# EAGLE schematic midterm (EAGLE 9.3.1)
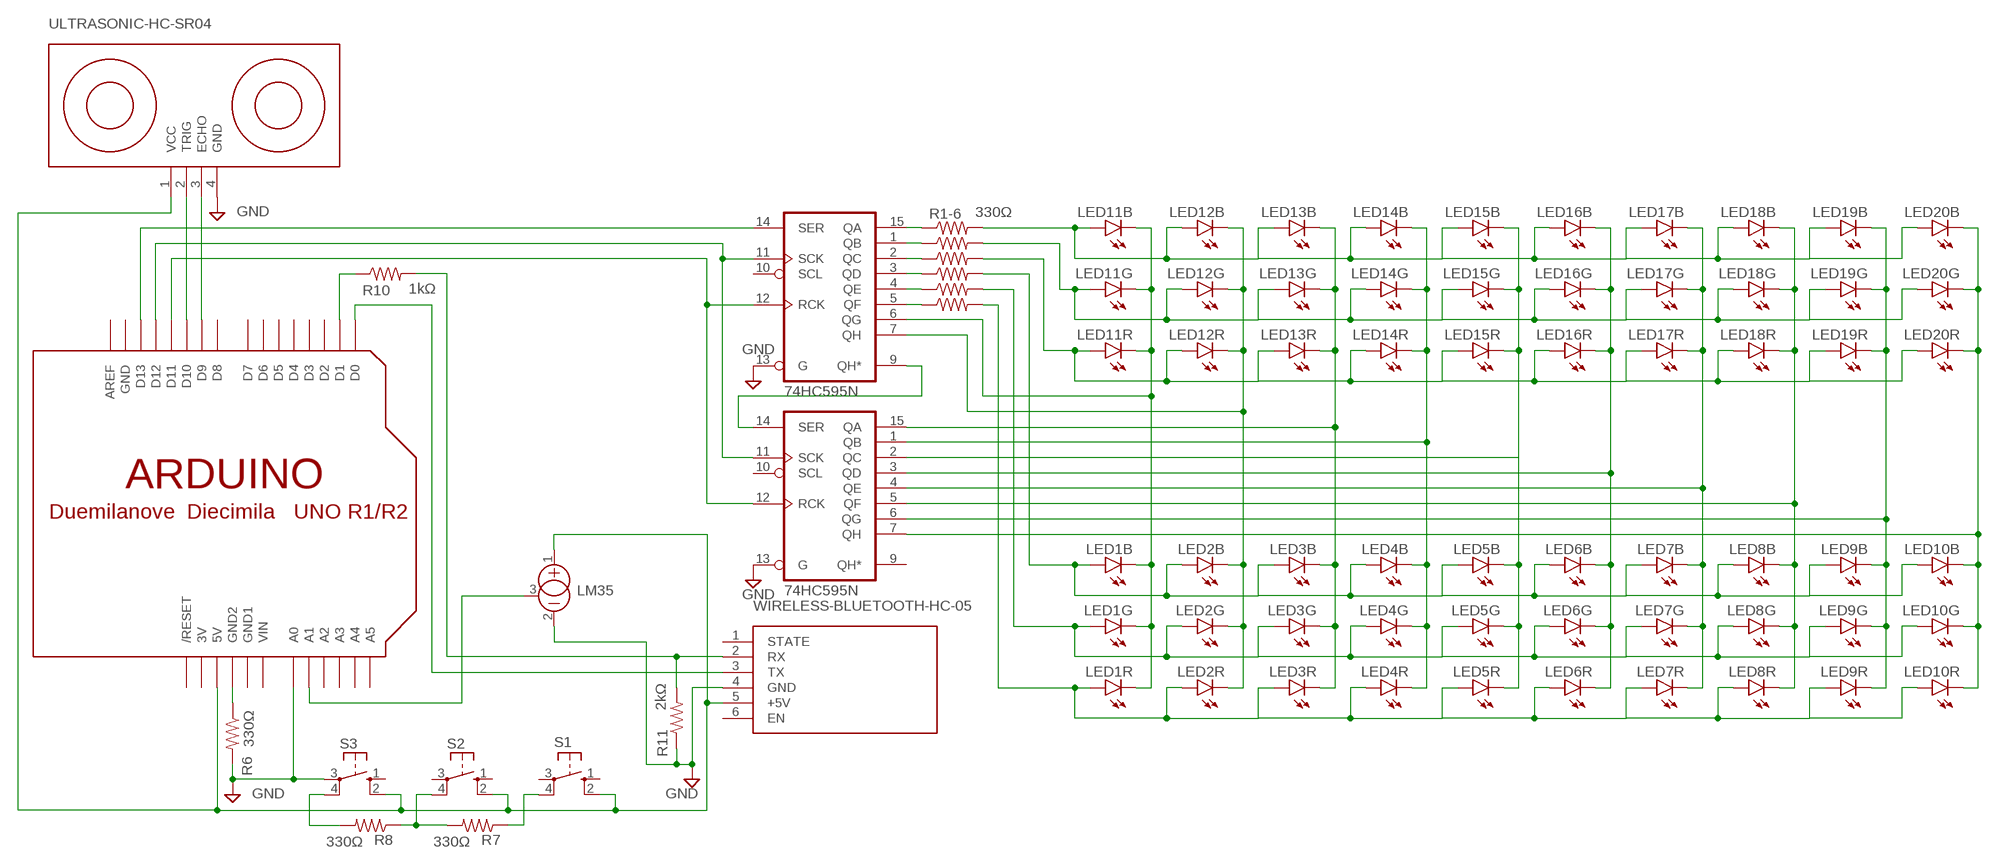
[diagram p0: schematic, sheet 1]

## Parts
IC1  74HC595N  [DIL16]
IC2  74HC595N  [DIL16]
LED1  GM5WA94310A  [GM5WA94310A]
LED2  GM5WA94310A  [GM5WA94310A]
LED3  GM5WA94310A  [GM5WA94310A]
LED4  GM5WA94310A  [GM5WA94310A]
LED5  GM5WA94310A  [GM5WA94310A]
LED6  GM5WA94310A  [GM5WA94310A]
LED7  GM5WA94310A  [GM5WA94310A]
LED8  GM5WA94310A  [GM5WA94310A]
LED9  GM5WA94310A  [GM5WA94310A]
LED10  GM5WA94310A  [GM5WA94310A]
LED11  GM5WA94310A  [GM5WA94310A]
LED12  GM5WA94310A  [GM5WA94310A]
LED13  GM5WA94310A  [GM5WA94310A]
LED14  GM5WA94310A  [GM5WA94310A]
LED15  GM5WA94310A  [GM5WA94310A]
LED16  GM5WA94310A  [GM5WA94310A]
LED17  GM5WA94310A  [GM5WA94310A]
LED18  GM5WA94310A  [GM5WA94310A]
LED19  GM5WA94310A  [GM5WA94310A]
LED20  GM5WA94310A  [GM5WA94310A]
LM35  AD590ZR  [TO92]
R1  R-US_0204/7  [0204/7]
R1-6  330Ω  R-US_0204/7  [0204/7]
R2  R-US_0204/7  [0204/7]
R3  R-US_0204/7  [0204/7]
R4  R-US_0204/7  [0204/7]
R5  R-US_0204/7  [0204/7]
R6  330Ω  R-US_0204/7  [0204/7]
R7  330Ω  R-US_0204/7  [0204/7]
R8  330Ω  R-US_0204/7  [0204/7]
R10  1kΩ  R-US_0204/7  [0204/7]
R11  2kΩ  R-US_0204/7  [0204/7]
S1  10-XX  [B3F-10XX]
S2  10-XX  [B3F-10XX]
S3  10-XX  [B3F-10XX]
U$1  ARDUINOUNO  [ARDUINO]
U$3  ULTRASONIC-HC-SR04  [ULTRASONIC-HC-SR04]
U$4  WIRELESS-BLUETOOTH-HC-05  [WIRELESS-BLUETOOTH-HC-05]

## Nets
GND: IC1.13(G) IC2.13(G) LM35.2(-) R6.2 R11.1 S3.3(P) U$1.A0 U$3.4(GND) U$4.4(GND)
N$1: IC1.6(QG) LED1.4(G:C) LED1.5(R:C) LED1.6(B:C) LED11.4(G:C) LED11.5(R:C) LED11.6(B:C)
N$2: IC1.9(QH*) IC2.14(SER)
N$3: IC1.11(SCK) IC2.11(SCK) U$1.D12
N$4: LM35.3(CAN) U$1.A1
N$5: IC1.7(QH) LED2.4(G:C) LED2.5(R:C) LED2.6(B:C) LED12.4(G:C) LED12.5(R:C) LED12.6(B:C)
N$6: IC2.15(QA) LED3.4(G:C) LED3.5(R:C) LED3.6(B:C) LED13.4(G:C) LED13.5(R:C) LED13.6(B:C)
N$7: LED1.1(B:A) LED2.1(B:A) LED3.1(B:A) LED4.1(B:A) LED5.1(B:A) LED6.1(B:A) LED7.1(B:A) LED8.1(B:A) LED9.1(B:A) LED10.1(B:A) R3.2
N$8: LED1.3(G:A) LED2.3(G:A) LED3.3(G:A) LED4.3(G:A) LED5.3(G:A) LED6.3(G:A) LED7.3(G:A) LED8.3(G:A) LED9.3(G:A) LED10.3(G:A) R2.2
N$9: LED1.2(R:A) LED2.2(R:A) LED3.2(R:A) LED4.2(R:A) LED5.2(R:A) LED6.2(R:A) LED7.2(R:A) LED8.2(R:A) LED9.2(R:A) LED10.2(R:A) R1.2
N$10: IC2.1(QB) LED4.4(G:C) LED4.5(R:C) LED4.6(B:C) LED14.4(G:C) LED14.5(R:C) LED14.6(B:C)
N$11: IC2.2(QC) LED5.4(G:C) LED5.5(R:C) LED5.6(B:C) LED15.4(G:C) LED15.5(R:C) LED15.6(B:C)
N$12: IC1.15(QA) R1-6.1
N$13: IC1.1(QB) R5.1
N$14: IC1.2(QC) R4.1
N$15: IC2.3(QD) LED6.4(G:C) LED6.5(R:C) LED6.6(B:C) LED16.4(G:C) LED16.5(R:C) LED16.6(B:C)
N$16: IC2.4(QE) LED7.4(G:C) LED7.5(R:C) LED7.6(B:C) LED17.4(G:C) LED17.5(R:C) LED17.6(B:C)
N$17: IC1.3(QD) R3.1
N$18: IC1.4(QE) R2.1
N$19: IC1.5(QF) R1.1
N$20: IC2.5(QF) LED8.4(G:C) LED8.5(R:C) LED8.6(B:C) LED18.4(G:C) LED18.5(R:C) LED18.6(B:C)
N$21: IC2.6(QG) LED9.4(G:C) LED9.5(R:C) LED9.6(B:C) LED19.4(G:C) LED19.5(R:C) LED19.6(B:C)
N$22: LM35.1(+) S1.2(S1) S2.2(S1) S3.2(S1) U$1.5V U$3.1(VCC) U$4.5(+5V)
N$23: R6.1 U$1.GND2
N$24: R7.1 S1.4(P1)
N$25: IC2.7(QH) LED10.4(G:C) LED10.5(R:C) LED10.6(B:C) LED20.4(G:C) LED20.5(R:C) LED20.6(B:C)
N$26: R7.2 R8.1 S2.4(P1)
N$27: R8.2 S3.4(P1)
N$28: IC1.14(SER) U$1.D13
N$29: U$1.D10 U$3.2(TRIG)
N$30: U$1.D9 U$3.3(ECHO)
N$32: R10.1 U$1.D1
N$33: R10.2 R11.2 U$4.2(RX)
N$34: U$1.D0 U$4.3(TX)
N$35: LED11.1(B:A) LED12.1(B:A) LED13.1(B:A) LED14.1(B:A) LED15.1(B:A) LED16.1(B:A) LED17.1(B:A) LED18.1(B:A) LED19.1(B:A) LED20.1(B:A) R1-6.2
N$36: LED11.3(G:A) LED12.3(G:A) LED13.3(G:A) LED14.3(G:A) LED15.3(G:A) LED16.3(G:A) LED17.3(G:A) LED18.3(G:A) LED19.3(G:A) LED20.3(G:A) R5.2
N$37: LED11.2(R:A) LED12.2(R:A) LED13.2(R:A) LED14.2(R:A) LED15.2(R:A) LED16.2(R:A) LED17.2(R:A) LED18.2(R:A) LED19.2(R:A) LED20.2(R:A) R4.2
N$38: IC1.12(RCK) IC2.12(RCK) U$1.D11
Unconnected: IC1.10(SCL) IC2.9(QH*) IC2.10(SCL) S1.1(S) S1.3(P) S2.1(S) S2.3(P) S3.1(S) U$1.A2 U$1.A3 U$1.A4 U$1.A5 U$1.AREF U$1.D2 U$1.D3 U$1.D4 U$1.D5 U$1.D6 U$1.D7 U$1.D8 U$1.RESET(/RESET) U$4.1(STATE) U$4.6(EN)

## Power pins joined to a net without a drawn wire
3V: U$1.3V
GND: IC1.8(GND) IC2.8(GND) U$1.GND
GND1: U$1.GND1
VCC: IC1.16(VCC) IC2.16(VCC)
VIN: U$1.VIN

## Library data of the parts
IC1 IC2 = 74xx-eu:74*595: 8-bit SHIFT REGISTER, output latch
LED1-LED20 = led:GM5WA94310A: Chip LED RGB Source: http://document.sharpsma.com/files/GM5WA94310A_SS.pdf
LM35 = linear:AD590ZR: TEMPERATURE SENSOR current output
R1 R1-6 R2-R8 R10 R11 = rcl:R-US_: RESISTOR, American symbol; SPICEPREFIX: R
S1-S3 = switch-omron:10-XX: OMRON SWITCH; MPN: B3F-1000; OC_FARNELL: 176432; OC_NEWARK: 36M3542
U$1 = adafruit:ARDUINO: Arduino Diecimila/Duemilanove Make a shield with ease, this package has all the named pins as well as the two mounting drill holes and an outline of the USB and DC power connector. The outline is on the DIMENSION layer, so if your board house uses it they will cut the outline to match. http://www.ladyada.net/library/pcb/eaglelibrary.html
U$3 = diy-modules:ULTRASONIC-HC-SR04: Ultrasonic Ranging Module HC-SR04 More details available here: http://randomnerdtutorials.com/complete-guide-for-ultrasonic-sensor-hc-sr04/ Click here to find device on ebay.com <http://www.ebay.com/sch/hc+sr04+ultrasonic>
U$4 = diy-modules:WIRELESS-BLUETOOTH-HC-05: Bluetooth Transceiver Module based on HC-05 board Tutorial is available here: https://arduino-info.wikispaces.com/BlueTooth-HC05-HC06-Modules-How-To Click here to find device on ebay.com <http://www.ebay.com/sch/hc-05+module+rs232>